# EAGLE schematic Dual linear VCA chip v3.0 - external trimmers - logo (EAGLE 6.5.0)
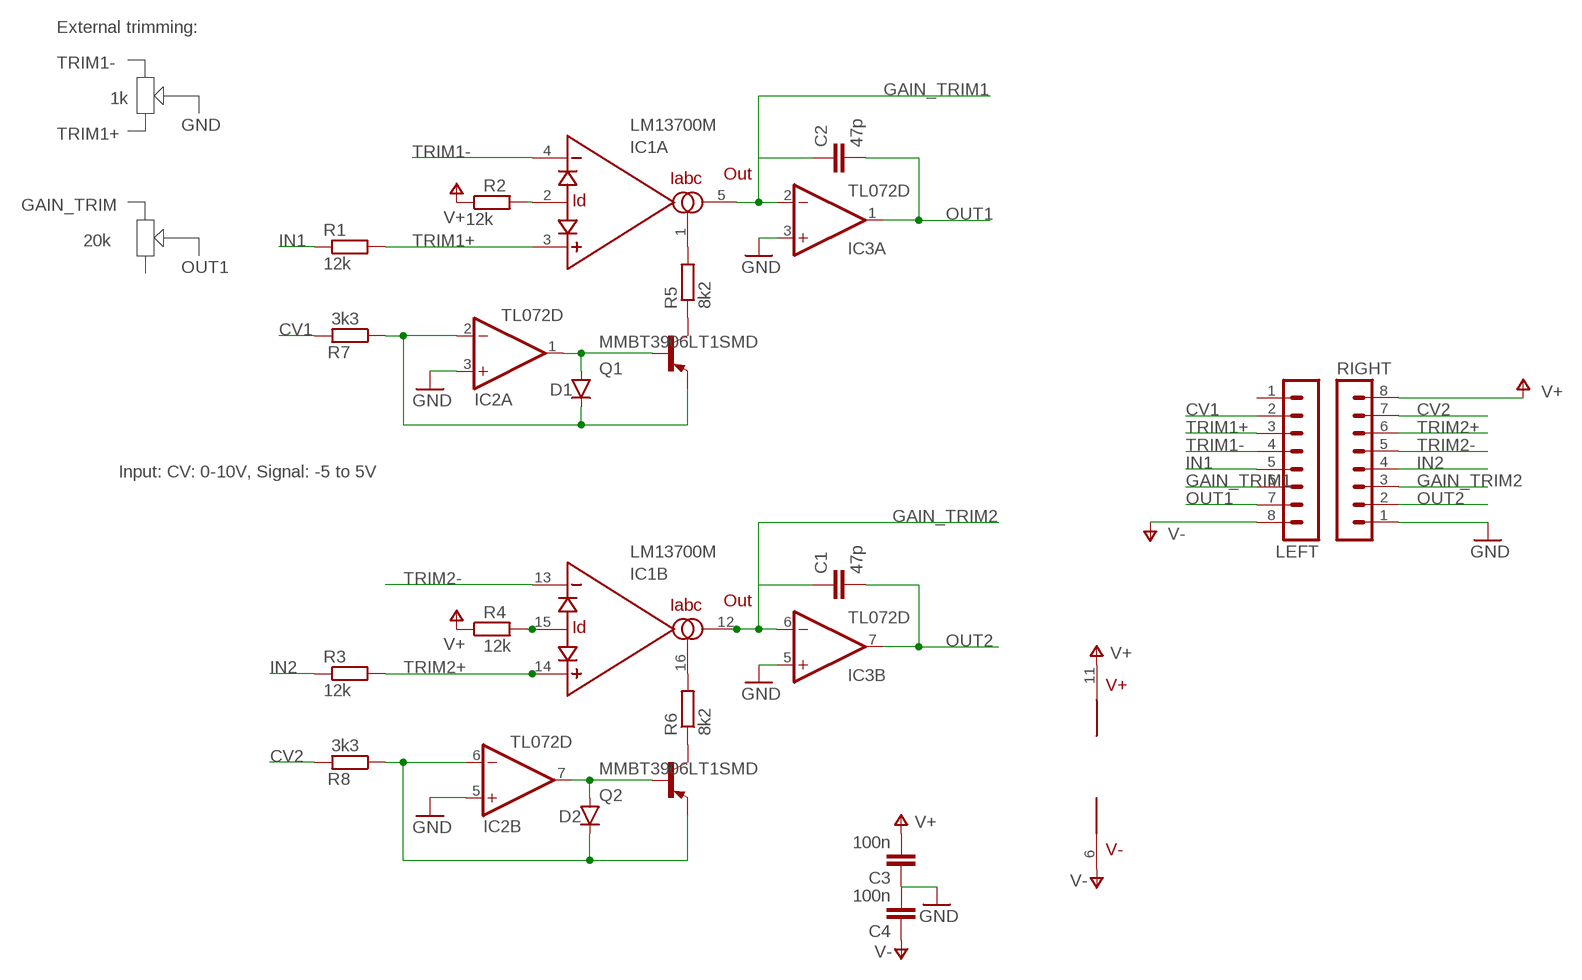
[diagram p0: schematic, sheet 1]

## Parts
C1  47p  C-EUC0805  [C0805]
C2  47p  C-EUC0805  [C0805]
C3  100n  C-EUC0805  [C0805]
C4  100n  C-EUC0805  [C0805]
D1  1N41480805  [D0805-J]
D2  1N41480805  [D0805-J]
IC1  LM13700M  [SO16]
IC2  TL072D  [SO08]
IC3  TL072D  [SO08]
LEFT  MA08-1JC  [MA08-1J]
Q1  MMBT3906LT1SMD  [SOT23-BEC]
Q2  MMBT3906LT1SMD  [SOT23-BEC]
R1  12k  R-EU_R0805  [R0805]
R2  12k  R-EU_R0805  [R0805]
R3  12k  R-EU_R0805  [R0805]
R4  12k  R-EU_R0805  [R0805]
R5  8k2  R-EU_R0805  [R0805]
R6  8k2  R-EU_R0805  [R0805]
R7  3k3  R-EU_R0805  [R0805]
R8  3k3  R-EU_R0805  [R0805]
RIGHT  MA08-1JC  [MA08-1J]

## Nets
CV1: LEFT.2 R7.2
CV2: R8.2 RIGHT.7
GAIN_TRIM1: C2.1 IC1.5(A:OUT) IC3.2(A:-IN) LEFT.6
GAIN_TRIM2: C1.1 IC1.12(B:OUT) IC3.6(B:-IN) RIGHT.3
GND: C3.1 C4.2 IC2.3(A:+IN) IC2.5(B:+IN) IC3.3(A:+IN) IC3.5(B:+IN) RIGHT.1
IN1: LEFT.5 R1.1
IN2: R3.1 RIGHT.4
N$1: Q1.C R5.1
N$2: Q2.C R6.1
N$3: D1.C IC2.2(A:-IN) Q1.E R7.1
N$4: IC1.1(A:IABC) R5.2
N$6: IC1.2(A:ID) R2.2
N$8: D2.A IC2.7(B:OUT) Q2.B
N$10: D1.A IC2.1(A:OUT) Q1.B
N$11: D2.C IC2.6(B:-IN) Q2.E R8.1
N$14: IC1.16(B:IABC) R6.2
N$17: IC1.15(B:ID) R4.2
OUT1: C2.2 IC3.1(A:OUT) LEFT.7
OUT2: C1.2 IC3.7(B:OUT) RIGHT.2
TRIM1+: IC1.3(A:+IN) LEFT.3 R1.2
TRIM1-: IC1.4(A:-IN) LEFT.4
TRIM2+: IC1.14(B:+IN) R3.2 RIGHT.6
TRIM2-: IC1.13(B:-IN) RIGHT.5
V+: C3.2 IC1.11(V+) R2.1 R4.1 RIGHT.8
V-: C4.1 IC1.6(V-) LEFT.8
Unconnected: IC1.7(IN) IC1.8(OUT) IC1.9(OUT) IC1.10(IN) LEFT.1

## Notes on the sheet
- External trimming:
- TRIM1-
- 1k
- GND
- TRIM1+
- GAIN_TRIM
- 20k
- OUT1
- Input: CV: 0-10V, Signal: -5 to 5V

## Power pins joined to a net without a drawn wire
V+: IC2.8(P:V+) IC3.8(P:V+)
V-: IC2.4(P:V-) IC3.4(P:V-)

## Library data of the parts
C1-C4 = resistor:C-EU: CAPACITOR, European symbol
D1 D2 = joakim:1N4148: DIODE high speed (Philips)
IC1 = synthdiy:LM13700: National Dual OTA with buffers.
IC2 IC3 = linear:TL072: OP AMP
LEFT RIGHT = joakim:MA08-1J: PIN HEADER; OC_FARNELL: unknown; OC_NEWARK: unknown
Q1 Q2 = transistor-pnp:MMBT3906*: PNP Transistror
R1-R8 = resistor:R-EU_: RESISTOR, European symbol